# Altium schematic sheet Sheet1.SchDoc
size A; SheetNumber: 1; SheetTotal: 1
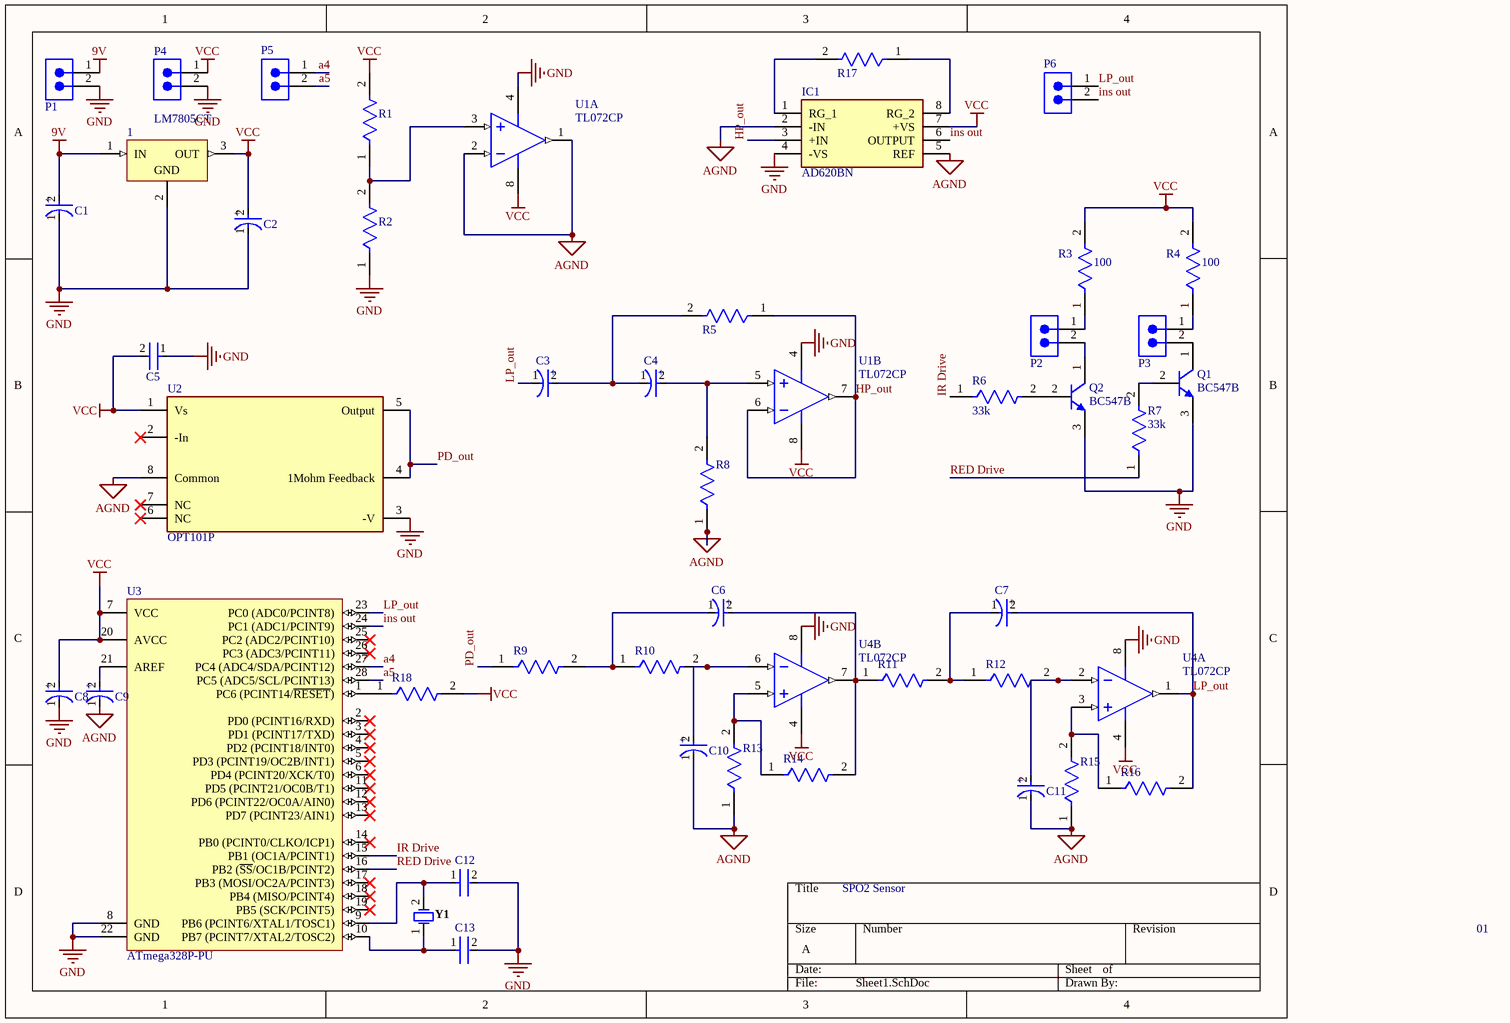
[diagram p0: Sheet1.SchDoc]

## Parts
1  LM7805CT  [FAIR-TO-220-3]
C1  EEUFC1H150  [FP-RAD-TH-D_5_0_5-L_11_1-MFG]  (value not drawn)
C2  EEUFC1H150  [FP-RAD-TH-D_5_0_5-L_11_1-MFG]  (value not drawn)
C3  EEUFC1H150  [FP-RAD-TH-D_5_0_5-L_11_1-MFG]  (value not drawn)
C4  EEUFC1H150  [FP-RAD-TH-D_5_0_5-L_11_1-MFG]  (value not drawn)
C5  RCER72A104K1DBH03A  [FP-RCE1A2-MFG]  (value not drawn)
C6  EEUFC1H150  [FP-RAD-TH-D_5_0_5-L_11_1-MFG]  (value not drawn)
C7  EEUFC1H150  [FP-RAD-TH-D_5_0_5-L_11_1-MFG]  (value not drawn)
C8  EEUFC1H150  [FP-RAD-TH-D_5_0_5-L_11_1-MFG]  (value not drawn)
C9  EEUFC1H150  [FP-RAD-TH-D_5_0_5-L_11_1-MFG]  (value not drawn)
C10  EEUFC1H150  [FP-RAD-TH-D_5_0_5-L_11_1-MFG]  (value not drawn)
C11  EEUFC1H150  [FP-RAD-TH-D_5_0_5-L_11_1-MFG]  (value not drawn)
C12  RCE5C2A102J0K1H03B  [FP-RCE0K1-MFG]  (value not drawn)
C13  RCE5C2A102J0K1H03B  [FP-RCE0K1-MFG]  (value not drawn)
IC1  AD620BN  [DIP794W56P254L959H533Q8N]
P1  TSW-102-26-F-S  [SMTC-TSW-102-26-XX-S]  (value not drawn)
P2  TSW-102-26-F-S  [SMTC-TSW-102-26-XX-S]  (value not drawn)
P3  TSW-102-26-F-S  [SMTC-TSW-102-26-XX-S]  (value not drawn)
P4  TSW-102-26-F-S  [SMTC-TSW-102-26-XX-S]  (value not drawn)
P5  TSW-102-26-F-S  [SMTC-TSW-102-26-XX-S]  (value not drawn)
P6  TSW-102-26-F-S  [SMTC-TSW-102-26-XX-S]  (value not drawn)
Q1  BC547B  [ONSC-TO-92-3-29-11]
Q2  BC547B  [ONSC-TO-92-3-29-11]
R1  RLR07C1002FSB14  [FP-RLR07-MFG]  (value not drawn)
R2  RLR07C1002FSB14  [FP-RLR07-MFG]  (value not drawn)
R3  100  [FP-RLR07-MFG]
R4  100  [FP-RLR07-MFG]
R5  RLR07C1002FSB14  [FP-RLR07-MFG]  (value not drawn)
R6  33k  [FP-RLR07-MFG]
R7  33k  [FP-RLR07-MFG]
R8  RLR07C1002FSB14  [FP-RLR07-MFG]  (value not drawn)
R9  RLR07C1002FSB14  [FP-RLR07-MFG]  (value not drawn)
R10  RLR07C1002FSB14  [FP-RLR07-MFG]  (value not drawn)
R11  RLR07C1002FSB14  [FP-RLR07-MFG]  (value not drawn)
R12  RLR07C1002FSB14  [FP-RLR07-MFG]  (value not drawn)
R13  RLR07C1002FSB14  [FP-RLR07-MFG]  (value not drawn)
R14  RLR07C1002FSB14  [FP-RLR07-MFG]  (value not drawn)
R15  RLR07C1002FSB14  [FP-RLR07-MFG]  (value not drawn)
R16  RLR07C1002FSB14  [FP-RLR07-MFG]  (value not drawn)
R17  RLR07C1002FSB14  [FP-RLR07-MFG]  (value not drawn)
R18  RLR07C1002FSB14  [FP-RLR07-MFG]  (value not drawn)
U1  TL072CP  [P0008A]  (parts A,B of 2)
U2  OPT101P  [FP-NTC0008A-MFG]
U3  ATmega328P-PU  [28P3]
U4  TL072CP  [P0008A]  (parts A,B of 2)
Y1  FOXSLF/160-20  [FOX-FOXSLF160-20]  (value not drawn)

## Nets
9V: 1.1(IN) C1.2(A) P1.1
AGND: C9.1(C) C10.1(C) C11.1(C) IC1.2(-IN) IC1.5(REF) R8.1 R13.1 R15.1 U1.1(OUT1) U1.2(IN1-) U2.8(Common)
GND: 1.2(GND) C1.1(C) C2.1(C) C5.1 C8.1(C) C12.2 C13.2 IC1.4(-VS) P1.2 P4.2 Q1.3(E) Q2.3(E) R2.1 U1.4(VCC-) U2.3(-V) U3.8(GND) U3.22(GND) U4.8(VCC+)
VCC: 1.3(OUT) C2.2(A) C5.2 C8.2(A) IC1.7(+VS) P4.1 R1.2 R3.2 R4.2 R18.2 U1.8(VCC+) U2.1(Vs) U3.7(VCC) U3.20(AVCC) U4.4(VCC-)
a4: P5.1 U3.27(PC4_(ADC4/SDA/PCINT12))
a5: P5.2 U3.28(PC5_(ADC5/SCL/PCINT13))
HP_out: IC1.3(+IN) R5.1 U1.6(IN2-) U1.7(OUT2)
ins out: IC1.6(OUTPUT) P6.2 U3.24(PC1_(ADC1/PCINT9))
IR Drive: R6.1 U3.15(PB1_(OC1A/PCINT1))
LP_out: C3.1(C) C7.2(A) P6.1 R16.2 U3.23(PC0_(ADC0/PCINT8)) U4.1(OUT1)
PD_out: R9.1 U2.4(1Mohm_Feedback) U2.5(Output)
RED Drive: R7.1 U3.16(PB2_(~{SS}/OC1B/PCINT2))
NetC3_2: C3.2(A) C4.1(C) R5.2
NetC4_2: C4.2(A) R8.2 U1.5(IN2+)
NetC6_1: C6.1(C) R9.2 R10.1
NetC6_2: C6.2(A) R11.1 R14.2 U4.7(OUT2)
NetC7_1: C7.1(C) R11.2 R12.1
NetC9_2: C9.2(A) U3.21(AREF)
NetC10_2: C10.2(A) R10.2 U4.6(IN2-)
NetC11_2: C11.2(A) R12.2 U4.2(IN1-)
NetC12_1: C12.1 U3.9(PB6_(PCINT6/XTAL1/TOSC1)) Y1.2
NetC13_1: C13.1 U3.10(PB7_(PCINT7/XTAL2/TOSC2)) Y1.1
NetIC1_1: IC1.1(RG_1) R17.2
NetIC1_8: IC1.8(RG_2) R17.1
NetP2_1: P2.1 R3.1
NetP2_2: P2.2 Q2.1(C)
NetP3_1: P3.1 R4.1
NetP3_2: P3.2 Q1.1(C)
NetQ1_2: Q1.2(B) R7.2
NetQ2_2: Q2.2(B) R6.2
NetR1_1: R1.1 R2.2 U1.3(IN1+)
NetR13_2: R13.2 R14.1 U4.5(IN2+)
NetR15_2: R15.2 R16.1 U4.3(IN1+)
NetR18_1: R18.1 U3.1(PC6_(PCINT14/~{RESET}))

Not connected (* = marked no-connect by the designer): U2 2(-In)* 6(NC)* 7(NC)*; U3 2(PD0_(PCINT16/RXD))* 3(PD1_(PCINT17/TXD))* 4(PD2_(PCINT18/INT0))* 5(PD3_(PCINT19/OC2B/INT1))* 6(PD4_(PCINT20/XCK/T0))* 11(PD5_(PCINT21/OC0B/T1))* 12(PD6_(PCINT22/OC0A/AIN0))* 13(PD7_(PCINT23/AIN1))* 14(PB0_(PCINT0/CLKO/ICP1))* 17(PB3_(MOSI/OC2A/PCINT3))* 18(PB4_(MISO/PCINT4))* 19(PB5_(SCK/PCINT5))* 25(PC2_(ADC2/PCINT10))* 26(PC3_(ADC3/PCINT11))*

## Notes on the sheet
- SPO2 Sensor
- 01
- (in symbol CMP-05427-000984-1) +

## Library data of the parts
1 = CMP-019-00050-1: Fixed Positive Standard Regulator, 5VBIPolar, PSFM3; Max Supply Voltage: 25V; Pins: 3; Case/Package: TO-220; RoHS Compliant: Yes
C1-C4 C6-C11 = CMP-05427-000984-1: Aluminum Electrolytic Capacitors (Radial Lead Type) AEC-Q200 Qualified 15uF ±20% 50V; Impedance: 1.3R; Leakage Current: 3uA; Lead Diameter: 0.5mm; Ripple Current: 145mA; Life (Hours): 1000Hour; Dielectric Material: Aluminium; Polarity: Polar; Length: 11mm; Width: 0.25inch; Tolerance: 20%; Height - Seated (Max): 0.433inch; Lead Pitch: 2mm; Diameter: 5mm; Lead Free: Lead Free; Capacitance: 15uF; Ratings: AEC-Q200; RoHS Compliant: Yes; Voltage: 50V; Number of Pins: 2; Mount: Through Hole; Construction: RADIAL; Termination: Radial; Contact Plating: Tin; Voltage Rating (DC): 50V; ESR (Equivalent Series Resistance): 1.3R; Case/Package: Radial; Weight: 0.01lb; Radiation Hardening: No; Package Quantity: 200; Min Operating Temperature: -55°C; REACH SVHC: No SVHC; Voltage Rating: 50V; Height: 11mm; Max Operating Temperature: 105°C; Series: FC; Packaging: Bulk
C5 = CMP-06035-052488-1: Cap Ceramic 100nF 100V X7R ±10% Radial 2.5mm +125°C Automotive Ammo Pack; Lead/Base Style: Straight; Lead Diameter: 0.5mm; Termination: Radial; Height: 3.5mm; Capacitance: 100nF; Ratings: AEC-Q200; Max Operating Temperature: 125°C; Min Operating Temperature: -55°C; Case/Package: Radial; Package Quantity: 2000; Resistor Type: Ceramic; Mount: Through Hole; Dielectric: X7R; Lead Free: Lead Free; Height - Seated (Max): 0.138inch; Width: 0.098inch; Tolerance: 10%; Packaging: Tape and Reel; Lead Pitch: 0.098inch; Length: 0.157inch; Voltage Rating: 100V; Voltage Rating (DC): 100V
C12 C13 = CMP-06035-012301-1: Cap Ceramic 1nF 100V C0G ±5% Radial 5mm +125°C Automotive Bulk; Lead Diameter: 0.5mm; Lead/Base Style: Formed Leads; Dielectric: C0G; Capacitance: 1nF; Length: 0.142inch; Max Operating Temperature: 125°C; Width: 0.098inch; Voltage Rating (DC): 100V; Resistor Type: Ceramic; Packaging: Bulk; Package Quantity: 500; Voltage Rating: 100V; Height: 3.5mm; Height - Seated (Max): 0.138inch; Lead Pitch: 0.197inch; Tolerance: 5%; Termination: Radial; Case/Package: Radial; Mount: Through Hole; Min Operating Temperature: -55°C; Ratings: AEC-Q200
IC1 = AD620BN: Integrated Circuit; Manufacturer_Name: Rochester Electronics; Datasheet Link: https://www.analog.com/media/en/technical-documentation/data-sheets/ad620.pdf; Height: 5.33mm; Manufacturer_Part_Number: AD620BN
P1-P6 = CMP-1024-00329-1: 0.025" SQ Post Header, Through-hole, Vertical, -55 to 125 degC, 2.54 mm Pitch, 2-Pin, Male, RoHS; Manufacturer: Samtec; Pitch: 2.54 mm; PackageVersion: DM, 8/1988; ComponentLink2Description: Datasheet; PackageReference: TSW-102-26-XX-S; ComponentLink3URL: http://www.samtec.com/documents/webfiles/cpdf/TSW-XXX-XX-XXX-X-XX-XXX-MKT.pdf; ComponentLink2URL: http://www.samtec.com/documents/webfiles/pdf/TSW_TH.PDF; ComponentLink1Description: Manufacturer URL; DatasheetVersion: F-214; RoHS: True; ComponentLink3Description: Package Specification; PartNumber: TSW-102-26-F-S; Temperature Range: -55 to 125 degC; Orientation: Vertical; ComponentLink1URL: http://www.samtec.com; PackageDescription: .025[0.64] SQ. Post Terminal Strip Assembly; Mounting Technology: Through-hole
Q1 Q2 = CMP-1048-01467-1: Amplifier Transistor, NPN Silicon, 3-Pin TO-92, Bulk Box; Manufacturer: On Semiconductor; IC Continuous (A): 0.1; fT Min (MHz): 150; DatasheetVersion: Rev. 7; ComponentLink1URL: http://www.onsemi.com/; Polarity: NPN; RoHS: FALSE; ComponentLink1Description: Manufacturer URL; Packing: Bulk Box; PackageDescription: 3-Pin Transistor Outline, Body 4.825 x 3.685 mm, Pitch 1.27 mm; ComponentLink3URL: http://www.onsemi.cn/pub_link/Collateral/2N6426-D.PDF; ComponentLink2Description: Datasheet; PackageVersion: Rev. AM; PackageReference: TO-92-3-29-11_AM_SL; ComponentLink3Description: Package Specification; Mounting Technology: Through Hole; PartNumber: BC547B; ComponentLink2URL: http://www.onsemi.com/pub_link/Collateral/BC546-D.PDF
R1-R18 = CMP-00030-39449004-1: RLR07C1002FSB14 Fixed Resistor, Metal Film, 0.25W, 10000ohm, 250V, 1% +/-Tol, 100ppm/Cel, Through Hole Mount; Power Rating: 250mW; Lead Diameter: 640µm; Wire/Cable Diameter: 50.8µm; Lead Length: 38.1mm; Resistance: 10kΩ; Temperature Coefficient: 100ppm/°C; Military Standard: MIL-PRF-39017; Max Operating Temperature: 150°C; Width: 2.29mm; Mount: Through Hole; Composition: Metal Film; REACH SVHC: Unknown; Tolerance: 1%; Failure Rate: 0.001%; Min Operating Temperature: -65°C; Voltage Rating: 250V; Schedule B: 8533210090, 8533210090; Max Power Dissipation: 250mW; Length: 7.62mm; Case/Package: Conformal; Lead Free: Contains Lead; NexarPartId: 39449004; Radiation Hardening: No; Termination: Axial; Number of Pins: 14; RoHS: Non-Compliant; Packaging: Bulk; Features: Military, Moisture Resistant, Weldable; Number of Terminations: 2; Contact Plating: Lead, Tin; Diameter: 2.29mm; Voltage Rating (DC): 250V
U1 U4 = CMP-0017-00950-2: Dual Low-Noise JFET-Input General-Purpose Operational Amplifier, 7 to 36 V, 0 to 70 degC, 8-pin DIP (P8), Pb-Free (RoHS); Manufacturer: Texas Instruments; Sub Family: General Purpose Amplifier, High Supply Voltage Amplifier (>=30V); Total Supply Voltage(Max)(+5V is 5, +/-5V is 10): 36; Slew Rate(Typ)(V/us): 13; Vn at 1kHz(Typ)(nV/rtHz): 18; GBW(Typ)(MHz): 3; CMRR(Min)(dB): 70; Total Supply Voltage(Min)(+5V is 5, +/-5V is 10): 7; Vio (25C)(Max)(mV): 10; Rating: Catalog; IIB(Max)(pA): 200; Iq per channel(Max)(mA): 2.5; Number of Channels: 2; Mounting Technology: Through Hole; ComponentLink3Description: Package Specification; PartNumber: TL072CP; PackageVersion: 4040082/E, 04/2010; Eco-Plan: Pb-Free (RoHS); DatasheetVersion: SLOS080J; Offset Drift(Typ)(uV/C): 18; ComponentLink3URL: http://www.ti.com/litv/pdf/mpdi001b; PackageDescription: 8-Pin Plastic In-Line, Body 9.59 x 6.35 mm, Pitch 2.54 mm; Code_JEDEC: MS-001; ComponentLink2URL: http://www.ti.com/lit/ds/symlink/tl072.pdf; ComponentLink1Description: Manufacturer URL; ComponentLink2Description: Datasheet; ComponentLink1URL: http://www.ti.com/; PackageReference: P0008A
U2 = CMP-04942-000004-1: SENSOR OPT 650NM AMBIENT 8DIP; Settling Time: 160000ns; Response Frequency: 14kHz; Rise Time: 28000ns; Output Type: Voltage; Operating Supply Current: 120uA; Max Supply Voltage: 36V; Dark Current: 2.5pA; Responsivity: 0.45A/W; Min Supply Voltage: 2.7V; Number of Pins: 8; Height: 3.24mm; REACH SVHC: No SVHC; Radiation Hardening: No; Lead Free: Lead Free; Min Operating Temperature: 0°C; Series: -; Wavelength: 650nm; RoHS Compliant: Yes; Packaging: Rail/Tube; Fall Time: 28000ns; Contact Plating: Gold; Mount: Through Hole; Case/Package: PDIP; Max Frequency: 14kHz; Bandwidth: 14kHz; Length: 9.53mm; Width: 6.52mm; Package Quantity: 50; Max Operating Temperature: 70°C
U3 = CMP-0095-00013-2: 8-bit AVR Microcontroller, 32KB Flash, 1KB EEPROM, 2KB SRAM, 28-pin PDIP, Industrial Grade (-40°C to 85°C); PackageVersion: revB, Sep-2001; PackageDescription: 28-lead (0.300"/7.62mm Wide) Plastic Dual Inline Package (PDIP); DatasheetVersion: revD, May-2011; ComponentLink1Description: Manufacturer URL; ComponentLink1URL: http://www.atmel.com/; PackageReference: 28P3; ComponentLink2Description: ATmega48A/48PA/88A/88PA/168A/168PA/328/328P Datasheet; ComponentLink3URL: http://www.atmel.com/dyn/resources/prod_documents/8271S.pdf; ComponentLink2URL: http://www.atmel.com/dyn/resources/prod_documents/8271.pdf; ComponentLink3Description: ATmega48A/48PA/88A/88PA/168A/168PA/328/328P Summary
Y1 = CMP-1749-00003-1: Resistance Weld Thru-Hole Crystal, 16 MHz, -20 to 70 degC, 2-Pin THD, RoHS, Bulk; Voltage Rating: 250 V; Tolerance: 1%; Resistance: 221 kohm; Case\Package: Axial; Power Rating: 250 mW; RoHSCompliant: true; Package Quantity: 200; Packaging: Bulk; Min Operating Temperature: -55 degC; DatasheetVersion: Mar-15; ComponentLink1URL: http://www.foxonline.com/; Max Operating Temperature: 155 degC; PackageReference: FOXSLF160-20; Mount: Through Hole; PackageDescription: 2-Pin Through Hole Device, Body 11.35 x 4.65 mm; ComponentLink1Description: Manufacturer URL; ComponentLink2URL: http://www.foxonline.com/pdfs/hc49slf.pdf; ComponentLink2Description: Datasheet; Length: 0.248 inch